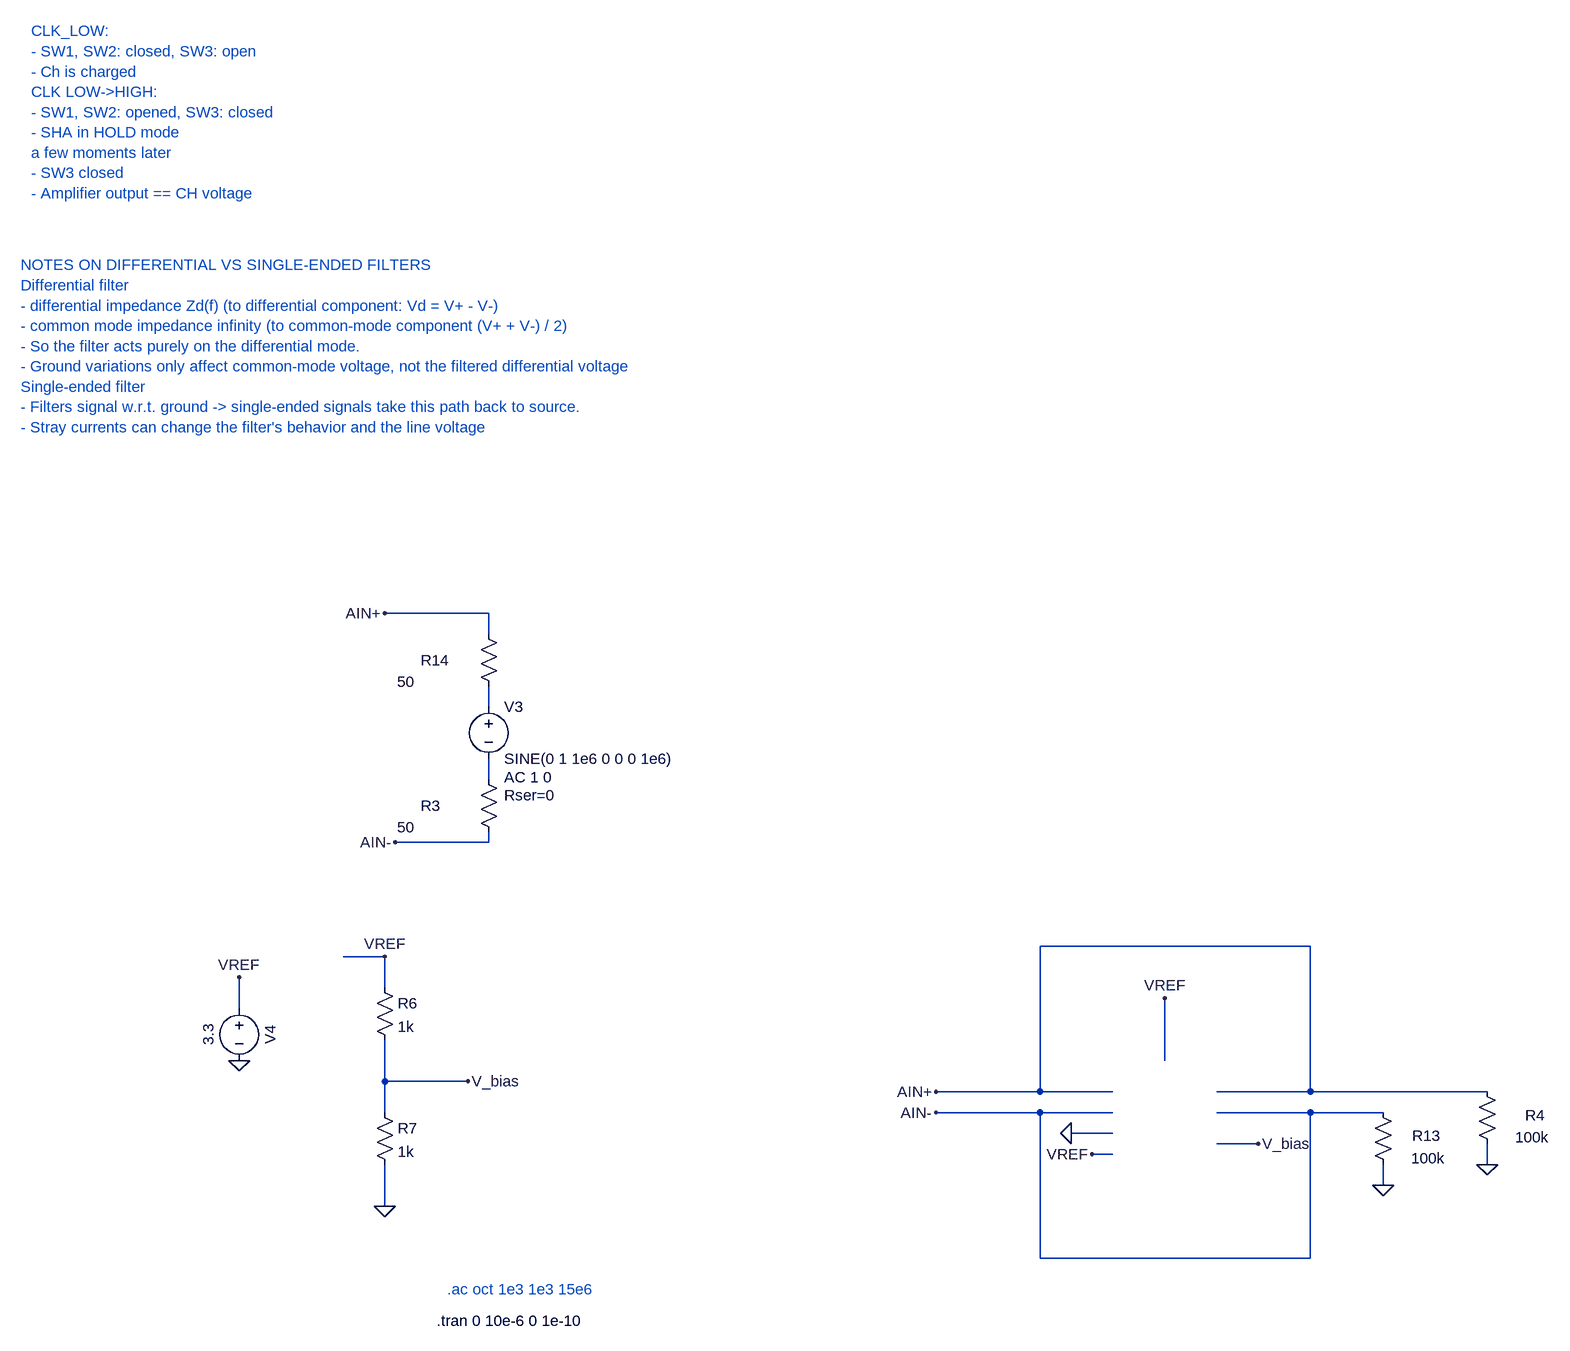
[diagram p0: schematic blocking_adc_frontend_buffered.asc]
blocking_adc_frontend_buffered.asc, the LTspice schematic file:
Version 4
SHEET 1 1884 2248
WIRE -2320 -80 -2480 -80
WIRE -2320 -48 -2320 -80
WIRE -2320 64 -2320 32
WIRE -2320 176 -2320 144
WIRE -2320 272 -2320 256
WIRE -2320 272 -2464 272
WIRE -1056 432 -1472 432
WIRE -2480 448 -2544 448
WIRE -2480 496 -2480 448
WIRE -2704 528 -2704 480
WIRE -1280 608 -1280 512
WIRE -2480 640 -2480 576
WIRE -2352 640 -2480 640
WIRE -1472 656 -1472 432
WIRE -1472 656 -1632 656
WIRE -1360 656 -1472 656
WIRE -1056 656 -1056 432
WIRE -1056 656 -1200 656
WIRE -784 656 -1056 656
WIRE -2480 688 -2480 640
WIRE -1472 688 -1632 688
WIRE -1360 688 -1472 688
WIRE -1056 688 -1200 688
WIRE -944 688 -1056 688
WIRE -1360 720 -1424 720
WIRE -1136 736 -1200 736
WIRE -1360 752 -1392 752
WIRE -784 768 -784 736
WIRE -944 800 -944 768
WIRE -2480 832 -2480 768
WIRE -1472 912 -1472 688
WIRE -1056 912 -1056 688
WIRE -1056 912 -1472 912
FLAG -2480 -80 AIN+
FLAG -2464 272 AIN-
FLAG -2480 832 0
FLAG -2352 640 V_bias
FLAG -2704 608 0
FLAG -2704 480 VREF
FLAG -2480 448 VREF
FLAG -1632 656 AIN+
FLAG -1632 688 AIN-
FLAG -1136 736 V_bias
FLAG -1280 512 VREF
FLAG -1424 720 0
FLAG -944 800 0
FLAG -784 768 0
FLAG -1392 752 VREF
SYMBOL voltage -2320 48 R0
WINDOW 123 24 124 Left 2
WINDOW 39 24 152 Left 2
SYMATTR Value2 AC 1 0
SYMATTR SpiceLine Rser=0
SYMATTR InstName V3
SYMATTR Value SINE(0 1 1e6 0 0 0 1e6)
SYMBOL res -2496 480 R0
SYMATTR InstName R6
SYMATTR Value 1k
SYMBOL res -2496 672 R0
SYMATTR InstName R7
SYMATTR Value 1k
SYMBOL voltage -2704 512 R0
WINDOW 0 32 56 VTop 2
WINDOW 3 -32 56 VBottom 2
WINDOW 123 0 0 Left 0
WINDOW 39 0 0 Left 0
SYMATTR InstName V4
SYMATTR Value 3.3
SYMBOL res -2336 -64 R0
WINDOW 0 -89 56 Left 2
WINDOW 3 -125 89 Left 2
SYMATTR InstName R14
SYMATTR Value 50
SYMBOL res -2336 160 R0
WINDOW 0 -89 56 Left 2
WINDOW 3 -125 89 Left 2
SYMATTR InstName R3
SYMATTR Value 50
SYMBOL res -928 784 R180
WINDOW 0 -73 60 Left 2
WINDOW 3 -80 26 Left 2
SYMATTR InstName R13
SYMATTR Value 100k
SYMBOL res -768 752 R180
WINDOW 0 -73 60 Left 2
WINDOW 3 -80 26 Left 2
SYMATTR InstName R4
SYMATTR Value 100k
TEXT -2400 1008 Left 2 !.tran 0 10e-6 0 1e-10
TEXT -3024 -976 Left 2 ;CLK_LOW:\n- SW1, SW2: closed, SW3: open\n- Ch is charged\nCLK LOW->HIGH:\n- SW1, SW2: opened, SW3: closed\n- SHA in HOLD mode\na few moments later\n- SW3 closed\n- Amplifier output == CH voltage
TEXT -2384 960 Left 2 ;.ac oct 1e3 1e3 15e6
TEXT -3040 -616 Left 2 ;NOTES ON DIFFERENTIAL VS SINGLE-ENDED FILTERS\nDifferential filter\n- differential impedance Zd(f) (to differential component: Vd = V+ - V-)\n- common mode impedance infinity (to common-mode component (V+ + V-) / 2) \n- So the filter acts purely on the differential mode.\n- Ground variations only affect common-mode voltage, not the filtered differential voltage\nSingle-ended filter\n- Filters signal w.r.t. ground -> single-ended signals take this path back to source.\n- Stray currents can change the filter's behavior and the line voltage

The netlist it stands for:
* blocking_adc_frontend_buffered.asc
V3 N001 N002 SINE(0 1 1e6 0 0 0 1e6) AC 1 0 Rser=0
R6 VREF V_bias 1k
R7 V_bias 0 1k
V4 VREF 0 3.3
R14 AIN+ N001 50
R3 N002 AIN- 50
R13 0 AIN- 100k
R4 0 AIN+ 100k
.tran 0 10e-6 0 1e-10
* CLK_LOW:
* - SW1, SW2: closed, SW3: open
* - Ch is charged
* CLK LOW->HIGH:
* - SW1, SW2: opened, SW3: closed
* - SHA in HOLD mode
* a few moments later
* - SW3 closed
* - Amplifier output == CH voltage
* .ac oct 1e3 1e3 15e6
* NOTES ON DIFFERENTIAL VS SINGLE-ENDED FILTERS
* Differential filter
* - differential impedance Zd(f) (to differential component: Vd = V+ - V-)
* - common mode impedance infinity (to common-mode component (V+ + V-) / 2)
* - So the filter acts purely on the differential mode.
* - Ground variations only affect common-mode voltage, not the filtered differential voltage
* Single-ended filter
* - Filters signal w.r.t. ground -> single-ended signals take this path back to source.
* - Stray currents can change the filter's behavior and the line voltage
.backanno
.end